# Altium schematic sheet XOR_GATE.SchDoc
size A
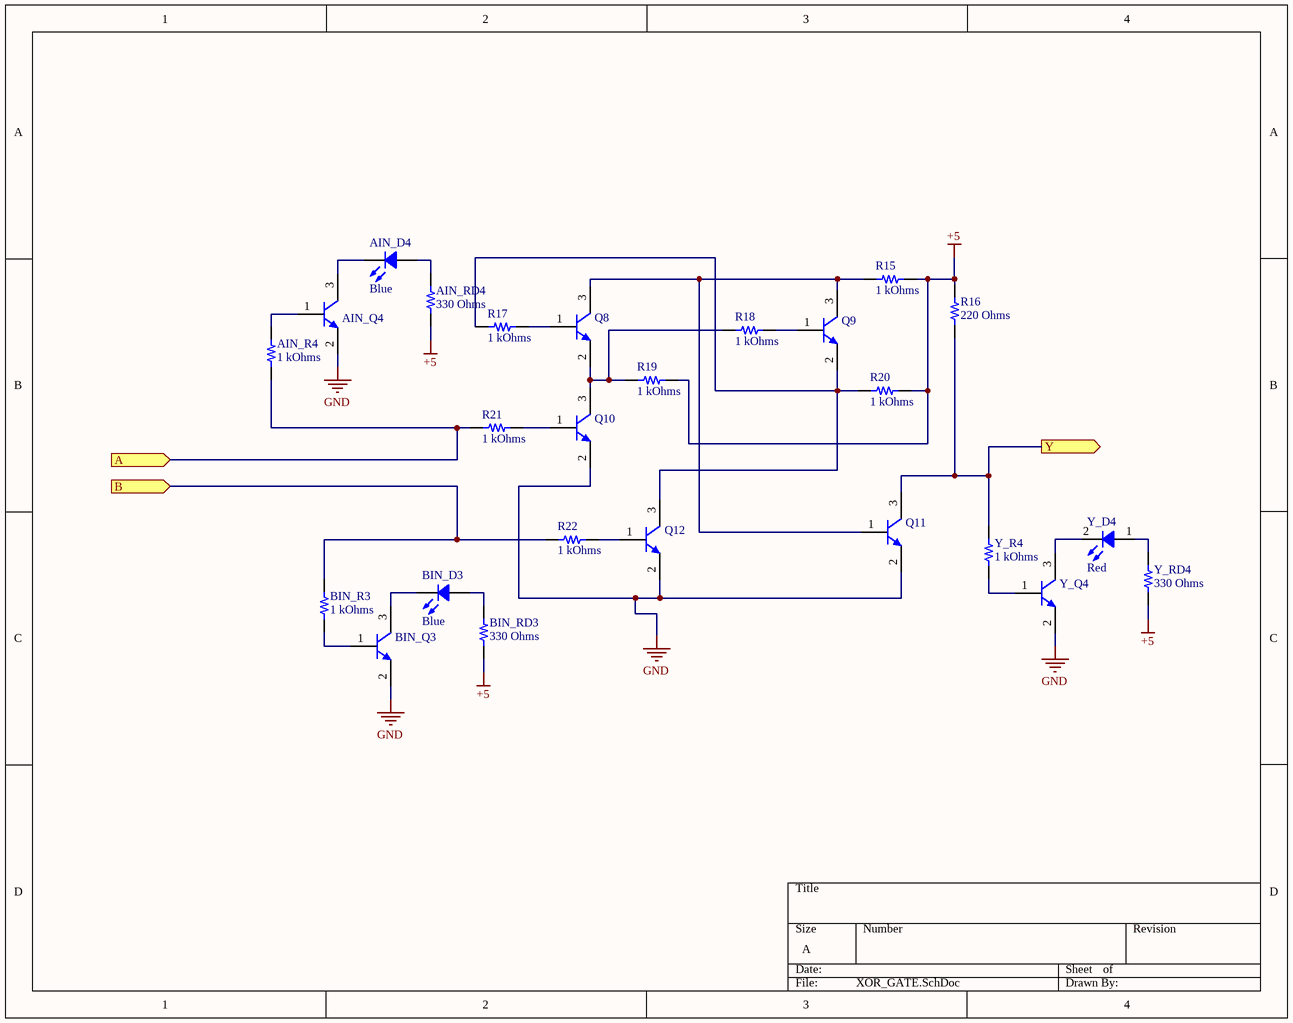
[diagram p0: XOR_GATE.SchDoc]

## Parts
AIN_D4  Blue  [LED 0603_1608 BLUE]
AIN_Q4  MMSS8050-L-TP  [MCCSEMI SOT-23-3]  (value not drawn)
AIN_R4  1 kOhms  [RES 0603_1608]
AIN_RD4  330 Ohms  [RES 0603_1608]
BIN_D3  Blue  [LED 0603_1608 BLUE]
BIN_Q3  MMSS8050-L-TP  [MCCSEMI SOT-23-3]  (value not drawn)
BIN_R3  1 kOhms  [RES 0603_1608]
BIN_RD3  330 Ohms  [RES 0603_1608]
Q8  MMSS8050-L-TP  [MCCSEMI SOT-23-3]  (value not drawn)
Q9  MMSS8050-L-TP  [MCCSEMI SOT-23-3]  (value not drawn)
Q10  MMSS8050-L-TP  [MCCSEMI SOT-23-3]  (value not drawn)
Q11  MMSS8050-L-TP  [MCCSEMI SOT-23-3]  (value not drawn)
Q12  MMSS8050-L-TP  [MCCSEMI SOT-23-3]  (value not drawn)
R15  1 kOhms  [RES 0603_1608]
R16  220 Ohms  [RES 0603_1608]
R17  1 kOhms  [RES 0603_1608]
R18  1 kOhms  [RES 0603_1608]
R19  1 kOhms  [RES 0603_1608]
R20  1 kOhms  [RES 0603_1608]
R21  1 kOhms  [RES 0603_1608]
R22  1 kOhms  [RES 0603_1608]
Y_D4  Red  [LED 0603_1608 RED]
Y_Q4  MMSS8050-L-TP  [MCCSEMI SOT-23-3]  (value not drawn)
Y_R4  1 kOhms  [RES 0603_1608]
Y_RD4  330 Ohms  [RES 0603_1608]

## Ports
A (in), B (in), Y (out)

## Nets
+5: AIN_RD4.1 BIN_RD3.1 R15.2 R16.2 R19.2 R20.2 Y_RD4.1
GND: AIN_Q4.2(E) BIN_Q3.2(E) Q10.2(E) Q11.2(E) Q12.2(E) Y_Q4.2(E)
A: AIN_R4.2 R21.1 ; port A
B: BIN_R3.2 R22.1 ; port B
Y: Q11.3(C) R16.1 Y_R4.2 ; port Y
NetAIN_D4_1: AIN_D4.1 AIN_RD4.2
NetAIN_D4_2: AIN_D4.2 AIN_Q4.3(C)
NetAIN_Q4_1: AIN_Q4.1(B) AIN_R4.1
NetBIN_D3_1: BIN_D3.1 BIN_RD3.2
NetBIN_D3_2: BIN_D3.2 BIN_Q3.3(C)
NetBIN_Q3_1: BIN_Q3.1(B) BIN_R3.1
NetQ8_1: Q8.1(B) R17.2
NetQ8_2: Q8.2(E) Q10.3(C) R18.1 R19.1
NetQ8_3: Q8.3(C) Q9.3(C) Q11.1(B) R15.1
NetQ9_1: Q9.1(B) R18.2
NetQ9_2: Q9.2(E) Q12.3(C) R17.1 R20.1
NetQ10_1: Q10.1(B) R21.2
NetQ12_1: Q12.1(B) R22.2
NetY_D4_1: Y_D4.1 Y_RD4.2
NetY_D4_2: Y_D4.2 Y_Q4.3(C)
NetY_Q4_1: Y_Q4.1(B) Y_R4.1

## Library data of the parts
AIN_D4 BIN_D3 = IN-S63AT5B: LED BLUE CLEAR 0603 SMD; Manufacturer: Inolux; Configuration: Standard; Current - Test: 5mA; Lens Size: 1.15mm x 0.80mm; Lens Style: Rectangle with Flat Top; Millicandela Rating: 45mcd; Viewing Angle: 120°; Voltage - Forward (Vf) (Typ): 2.8V; Wavelength - Dominant: 470nm; Wavelength - Peak: 468nm; Part Number: IN-S63AT5B; Color: Blue; ComponentLink1Description: Datasheet; ComponentLink1URL: http://www.inolux-corp.com/datasheet/SMDLED/Mono%20Color%20Top%20View/IN-S63AT%20Series_V1.1.pdf; ComponentLink2Description: DigiKey Link; ComponentLink2URL: https://www.digikey.com/en/products/detail/inolux/IN-S63AT5B/7604929; Device Package: 0603 (1608 Metric); Height (Max): 0.40mm; LastUpdated: 6/3/2024 7:57:52 PM; Lens Color: Clear; Lens Transparency: Clear; Lifecycle Status: Active; Minimum Order: 1; Mounting Type: Surface Mount; Package / Case: 0603 (1608 Metric); Packaging: TapeAndReel; PartId: 834; Part Status: Active; Price: 0.03; Series: IN-S63AT; Size / Dimension: 1.60mm L x 0.80mm W; Supplier 1: DigiKey; Supplier Part Number 1: 1830-1061-1-ND; Supplier Device Package: 0603; Value: Blue
AIN_Q4 BIN_Q3 Q8-Q12 Y_Q4 = MMSS8050-L-TP: TRANS NPN 25V 1.5A SOT23; Manufacturer: Micro Commercial Co; Current - Collector Cutoff (Max): 100nA; DC Current Gain (hFE) (Min) @ Ic, Vce: 120 @ 100mA, 1V; Frequency - Transition: 100MHz; Power - Max: 625 mW; Vce Saturation (Max) @ Ib, Ic: 500mV @ 80mA, 800mA; Part Number: MMSS8050-L-TP; ComponentLink1Description: Datasheet; ComponentLink1URL: https://www.mccsemi.com/pdf/Products/MMSS8050(SOT-23).pdf; ComponentLink2Description: DigiKey Link; ComponentLink2URL: https://www.digikey.com/en/products/detail/micro-commercial-co/MMSS8050-L-TP/2827197; Current - Collector (Ic) (Max): 1.5 A; LastUpdated: 6/3/2024 8:24:16 PM; Lifecycle Status: Active; Minimum Order: 1; Mounting Type: Surface Mount; Operating Temperature: -55°C ~ 150°C (TJ); Package / Case: TO-236-3, SC-59, SOT-23-3; Packaging: TapeAndReel; PartId: 278; Part Status: Active; Price: 0.01; Series: -; Supplier 1: DigiKey; Supplier Part Number 1: MMSS8050-L-TPMSCT-ND; Supplier Device Package: SOT-23; Transistor Type: NPN; Voltage - Collector Emitter Breakdown (Max): 25 V
AIN_R4 BIN_R3 R15 R17-R22 Y_R4 = CPF0603B1K0E: RES SMD 1K OHM 0.1% 1/16W 0603; Manufacturer: TE Connectivity Passive Product; Power (Watts): 0.063W, 1/16W; Temperature Coefficient: ±25ppm/°C; Part Number: CPF0603B1K0E; Value: 1 kOhms; ComponentLink1Description: Datasheet; ComponentLink1URL: https://www.te.com/commerce/DocumentDelivery/DDEController?Action=srchrtrv&DocNm=1773200&DocType=DS&DocLang=English; ComponentLink2Description: DigiKey Link; ComponentLink2URL: https://www.digikey.com/en/products/detail/te-connectivity-passive-product/CPF0603B1K0E/2390473; Composition: Thin Film; Device Package: 0603 (1608 Metric); Height - Seated (Max): 0.022" (0.55mm); LastUpdated: 2/9/2024 8:43:37 PM; Lifecycle Status: Active; Minimum Order: 1; Number of Terminations: 2; Operating Temperature: -55°C ~ 155°C; Package / Case: 0603 (1608 Metric); Packaging: TapeAndReel; PartId: 4877; Part Status: Active; Price: 0.09; Resistance: 1 kOhms; Series: CPF, Neohm; Size / Dimension: 0.061" L x 0.031" W (1.55mm x 0.80mm); Supplier 1: DigiKey; Supplier Part Number 1: A119887CT-ND; Supplier Device Package: 0603; Tolerance: ±0.1%
AIN_RD4 BIN_RD3 Y_RD4 = RMCF0603JT330R: RES 330 OHM 5% 1/10W 0603; Manufacturer: Stackpole Electronics Inc; Power (Watts): 0.1W, 1/10W; Temperature Coefficient: ±200ppm/°C; Part Number: RMCF0603JT330R; Value: 330 Ohms; ComponentLink1Description: Datasheet; ComponentLink1URL: https://www.seielect.com/catalog/sei-rmcf_rmcp.pdf; ComponentLink2Description: DigiKey Link; ComponentLink2URL: https://www.digikey.com/en/products/detail/stackpole-electronics-inc/RMCF0603JT330R/1757998; Composition: Thick Film; Device Package: 0603 (1608 Metric); Features: Automotive AEC-Q200; Height - Seated (Max): 0.022" (0.55mm); LastUpdated: 2/9/2024 8:43:33 PM; Lifecycle Status: Active; Minimum Order: 1; Number of Terminations: 2; Operating Temperature: -55°C ~ 155°C; Package / Case: 0603 (1608 Metric); Packaging: CutTape; PartId: 5841; Part Status: Active; Price: 0.01; Ratings: AEC-Q200; Resistance: 330 Ohms; Series: RMCF; Size / Dimension: 0.061" L x 0.031" W (1.55mm x 0.80mm); Supplier 1: DigiKey; Supplier Part Number 1: RMCF0603JT330RCT-ND; Supplier Device Package: 0603; Tolerance: ±5%
R16 = ERA-3AED221V: RES SMD 220 OHM 0.5% 1/10W 0603; Manufacturer: Panasonic Electronic Components; Power (Watts): 0.1W, 1/10W; Temperature Coefficient: ±25ppm/°C; Part Number: ERA-3AED221V; Value: 220 Ohms; ComponentLink1Description: Datasheet; ComponentLink1URL: https://industrial.panasonic.com/cdbs/www-data/pdf/RDM0000/AOA0000C307.pdf; ComponentLink2Description: DigiKey Link; ComponentLink2URL: https://www.digikey.com/en/products/detail/panasonic-electronic-components/ERA-3AED221V/9373509; Composition: Thin Film; Device Package: 0603 (1608 Metric); Features: Automotive AEC-Q200; Height - Seated (Max): 0.022" (0.55mm); LastUpdated: 2/9/2024 8:43:36 PM; Lifecycle Status: Active; Minimum Order: 1; Number of Terminations: 2; Operating Temperature: -55°C ~ 155°C; Package / Case: 0603 (1608 Metric); Packaging: TapeAndReel; PartId: 4952; Part Status: Active; Price: 0.03; Ratings: AEC-Q200; Resistance: 220 Ohms; Series: ERA-3A; Size / Dimension: 0.063" L x 0.031" W (1.60mm x 0.80mm); Supplier 1: DigiKey; Supplier Part Number 1: P123752CT-ND; Supplier Device Package: 0603; Tolerance: ±0.5%
Y_D4 = XZMDK53W-8: LED RED CLEAR CHIP SMD; Manufacturer: SunLED; Configuration: Standard; Current - Test: 20mA; Lens Color: Colorless; Lens Size: 0.35mm Dia; Lens Style: Round with Domed Top; Millicandela Rating: 248mcd; Viewing Angle: 60°; Voltage - Forward (Vf) (Typ): 1.95V; Wavelength - Dominant: 630nm; Wavelength - Peak: 645nm; Part Number: XZMDK53W-8; Color: Red; ComponentLink1Description: Datasheet; ComponentLink1URL: https://www.sunledusa.com/products/spec/XZMDK53W-8.pdf; ComponentLink2Description: DigiKey Link; ComponentLink2URL: https://www.digikey.com/en/products/detail/sunled/XZMDK53W-8/4745952; Device Package: 0603 (1608 Metric); Height (Max): 0.95mm; LastUpdated: 6/3/2024 7:59:48 PM; Lens Transparency: Clear; Lifecycle Status: Active; Minimum Order: 1; Mounting Type: Surface Mount; Package / Case: 0603 (1608 Metric); Packaging: TapeAndReel; PartId: 401; Part Status: Active; Price: 0.06; Series: PixsoLED; Size / Dimension: 1.60mm L x 0.80mm W; Supplier 1: DigiKey; Supplier Part Number 1: 1497-1169-6-ND; Supplier Device Package: Chip LED; Value: Red